# EAGLE design CocoBra (EAGLE 6.3)
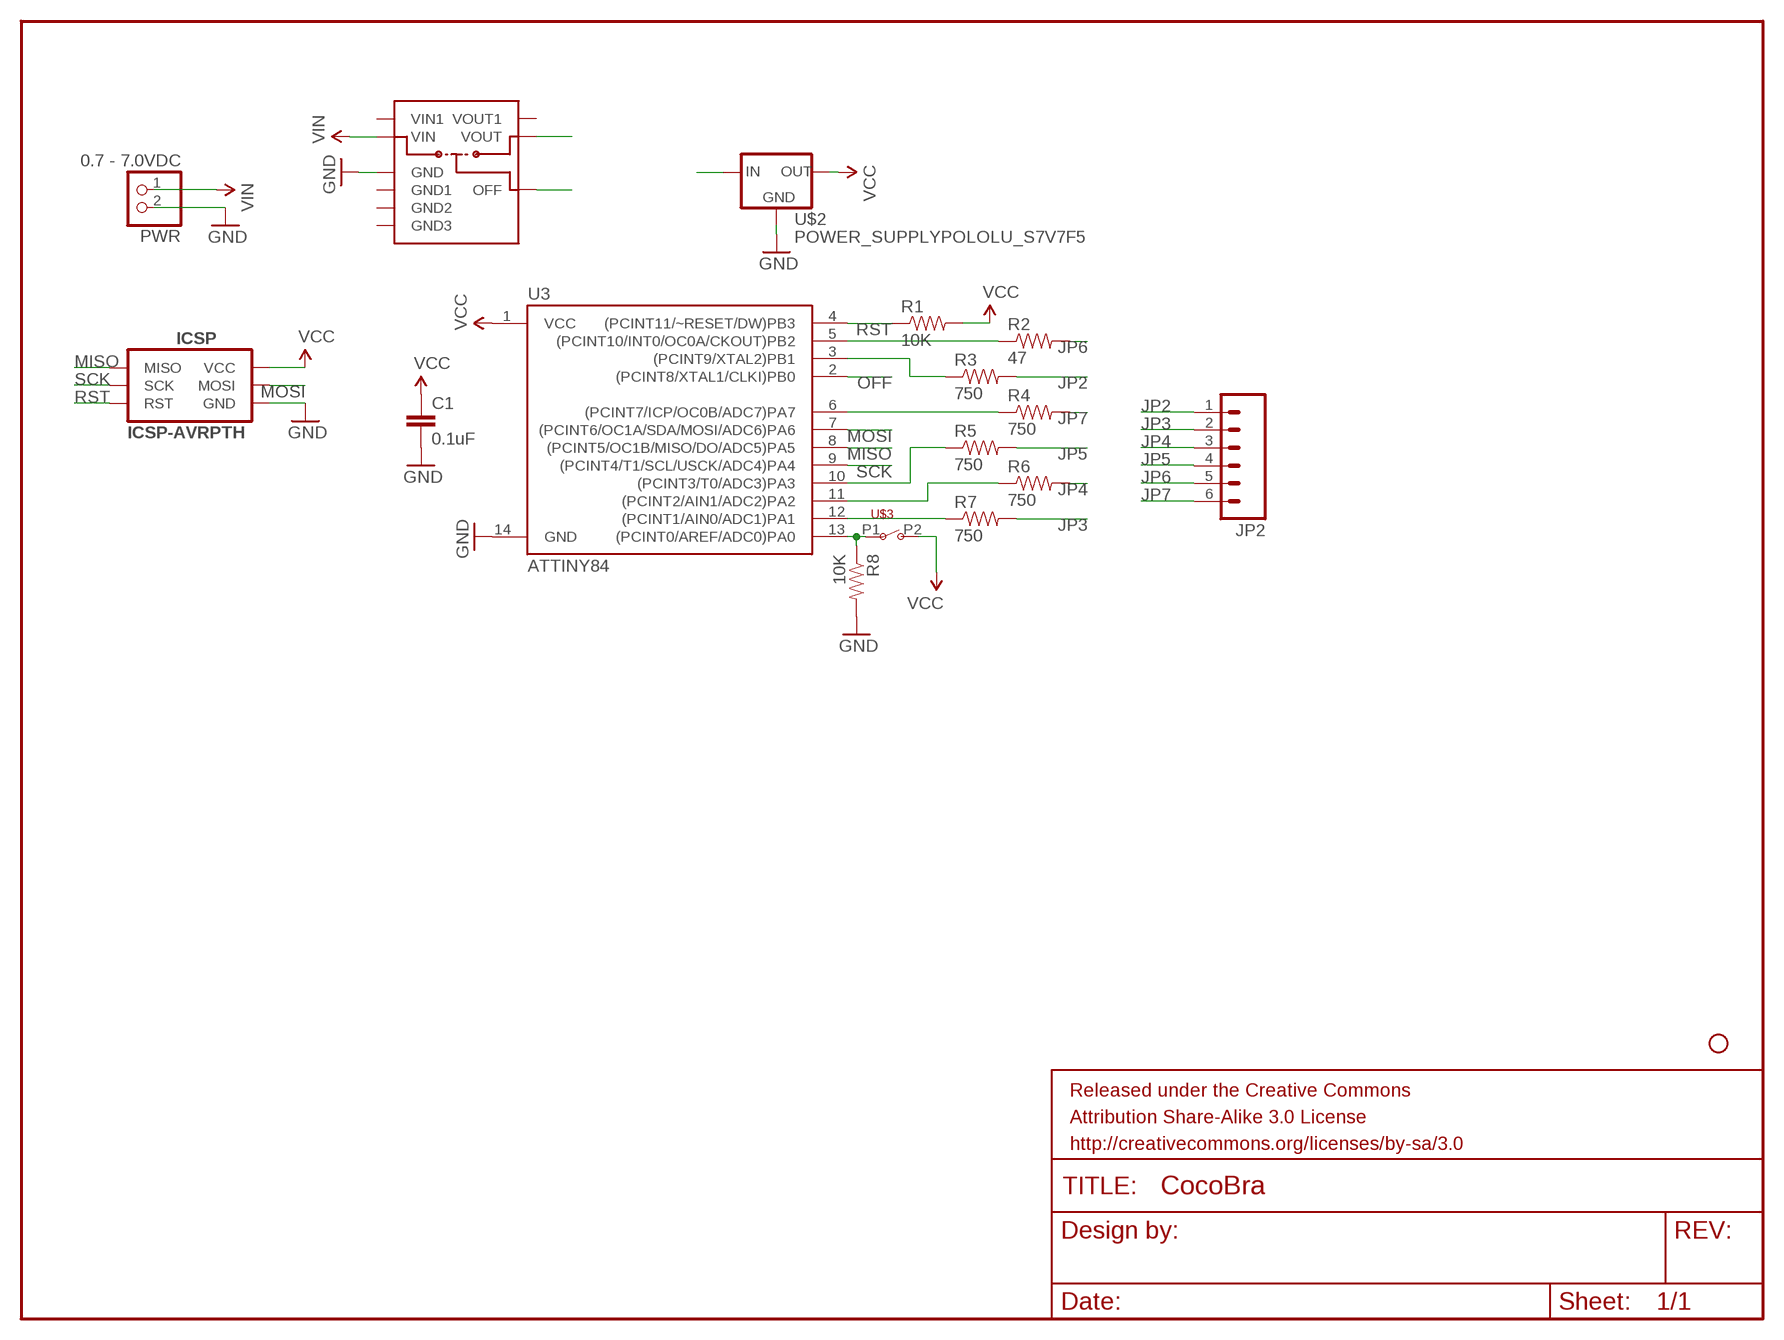
[diagram p0: schematic, sheet 1]

## Parts
C1  0.1uF  CAPPTH2  [CAP-PTH-SMALL2]
FRAME1  FRAME-LETTER  [CREATIVE_COMMONS]
ICSP  ICSP-AVRPTH  [2X3-SHROUDED]
JP2  M06SIP  [1X06]
PWR  0.7 - 7.0VDC  JST_2PIN-THM-RA  [JST-PH-2-THM-RA]
R1  10K  RESISTORAXIAL-0.2  [AXIAL-0.2]
R2  47  RESISTORAXIAL-0.3  [AXIAL-0.3]
R3  750  RESISTORAXIAL-0.3  [AXIAL-0.3]
R4  750  RESISTORAXIAL-0.3  [AXIAL-0.3]
R5  750  RESISTORAXIAL-0.3  [AXIAL-0.3]
R6  750  RESISTORAXIAL-0.3  [AXIAL-0.3]
R7  750  RESISTORAXIAL-0.3  [AXIAL-0.3]
R8  10K  RESISTORAXIAL-0.2  [AXIAL-0.2]
STANDOFF3  STAND-OFF#2  [STAND-OFF-#2]
U3  ATTINY84  ATTINY84DIL14  [DIL14]
U$2  POWER_SUPPLYPOLOLU_S7V7F5  [POLOLU_POWER_SUPPLY_S7V7F5]
U$3  SWITCH-SPSTTILT  [SWITCH-SPST-TILT]
U$4  POLOLU_POWER_SWITCHPTH  [POLOLU_POWER_SWITCH]

## Nets
GND [power]: C1.2 ICSP.6(GND) PWR.2 R8.P$2 U3.14(GND) U$2.GND U$4.GND
JP2: JP2.1 R3.P$2
JP3: JP2.2 R7.P$2
JP4: JP2.3 R6.P$2
JP5: JP2.4 R5.P$2
JP6: JP2.5 R2.P$2
JP7: JP2.6 R4.P$2
MISO: ICSP.1(MISO) U3.8((PCINT5/OC1B/MISO/DO/ADC5)PA5)
MOSI: ICSP.4(MOSI) U3.7((PCINT6/OC1A/SDA/MOSI/ADC6)PA6)
N$1: R2.P$1 U3.5((PCINT10/INT0/OC0A/CKOUT)PB2)
N$2: R3.P$1 U3.3((PCINT9/XTAL2)PB1)
N$3: R4.P$1 U3.6((PCINT7/ICP/OC0B/ADC7)PA7)
N$4: R5.P$1 U3.10((PCINT3/T0/ADC3)PA3)
N$5: R6.P$1 U3.11((PCINT2/AIN1/ADC2)PA2)
N$6: R7.P$1 U3.12((PCINT1/AIN0/ADC1)PA1)
N$7: R8.P$1 U3.13((PCINT0/AREF/ADC0)PA0) U$3.P1
OFF: U3.2((PCINT8/XTAL1/CLKI)PB0) U$4.OFF
RST: ICSP.5(RST) R1.P$1 U3.4((PCINT11/~RESET/DW)PB3)
SCK: ICSP.3(SCK) U3.9((PCINT4/T1/SCL/USCK/ADC4)PA4)
VCC: C1.1 ICSP.2(VCC) R1.P$2 U3.1(VCC) U$2.VOUT(OUT) U$3.P2
VIN [power]: PWR.1 U$4.VIN
VOUT: U$2.VIN(IN) U$4.VOUT
Unconnected: U$4.GND1 U$4.GND2 U$4.GND3 U$4.VIN1 U$4.VOUT1

## Library data of the parts
C1 = Dek:CAP: Capacitor Standard 0603 ceramic capacitor, and 0.1" leaded capacitor.
FRAME1 = SparkFun-Aesthetics:FRAME-LETTER: Schematic Frame Standard 8.5x11 US Letter frame
ICSP = Dek:ICSP-AVR
JP2 = SparkFun-Connectors:M06: Header 6 Standard 6-pin 0.1" header. Use with straight break away headers (SKU : PRT-00116), right angle break away headers (PRT-00553), swiss pins (PRT-00743), machine pins (PRT-00117), and female headers (PRT-00115). Molex polarized connector foot print use with SKU : PRT-08094 with associated crimp pins and housings. NOTES ON THE VARIANTS LOCK and LOCK_LONGPADS... This footprint was designed to help hold the alignment of a through-hole component (i.e. 6-pin header) while soldering it into place. You may notice that each hole has been shifted either up or down by 0.005 of an inch from it's more standard position (which is a perfectly straight line). This slight alteration caused the pins (the squares in the middle) to touch the edges of the holes. Because they are alternating, it causes a "brace" to hold the component in place. 0.005 has proven to be the perfect amount of "off-center" position when using our standard breakaway headers. Although looks a little odd when you look at the bare footprint, once you have a header in there, the alteration is very hard to notice. Also, if you push a header all the way into place, it is covered up entirely on the bottom side. This idea of altering the position of holes to aid alignment will be further integrated into the Sparkfun Library for other footprints. It can help hold any component with 3 or more connection pins.
PWR = Dek:JST_2PIN: JST 2-Pin Connectors of various flavors SMT-RA (S2B-PH-SM4) 4UConnector #17311 SMT (B2B-PH-SM4) THM-RA (S2B-PH) THM (B2B-PH)
R1-R8 = Dek:RESISTOR: Resistor Basic schematic elements and footprints for 0603, 1206, and PTH resistors.
STANDOFF3 = Dek:STAND-OFF: Stand Off This is the mechanical footprint for a #2 phillips button head screw. Use the keepout ring to avoid running the screw head into surrounding components.
U3 = Dek:ATTINY84: Atmel 14-pin 2/4/8kB flash uC
U$2 = Dek:POWER_SUPPLY
U$3 = Dek:SWITCH-SPST
U$4 = Dek:POLOLU_POWER_SWITCH

## Net classes
1 power: width 0.305 mm, clearance 0.305 mm

## Board
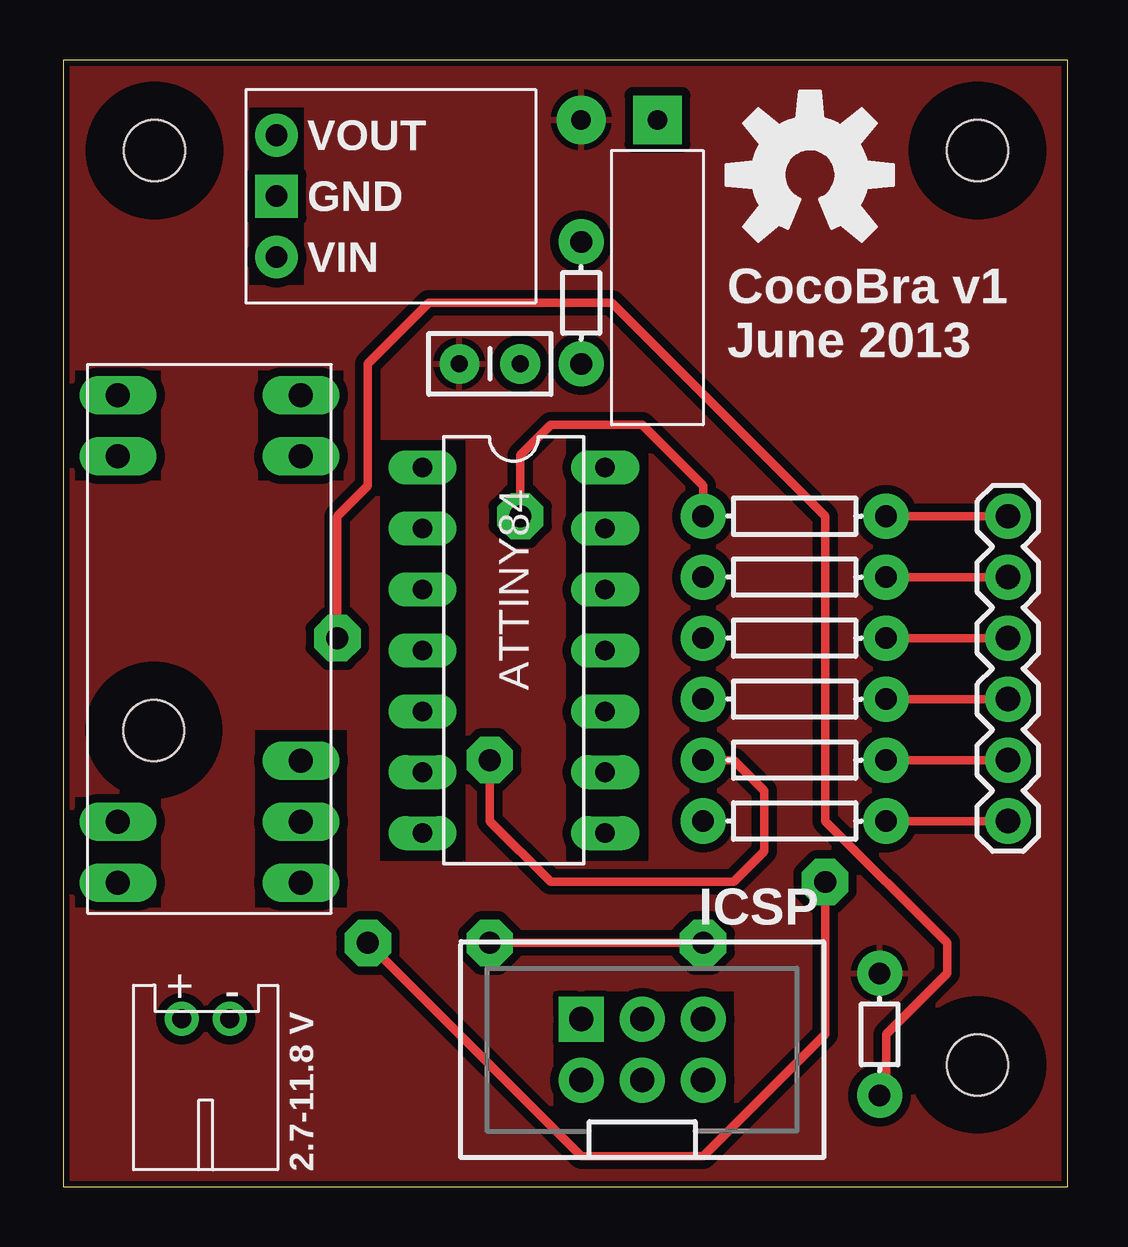
[diagram p1: board, top side]
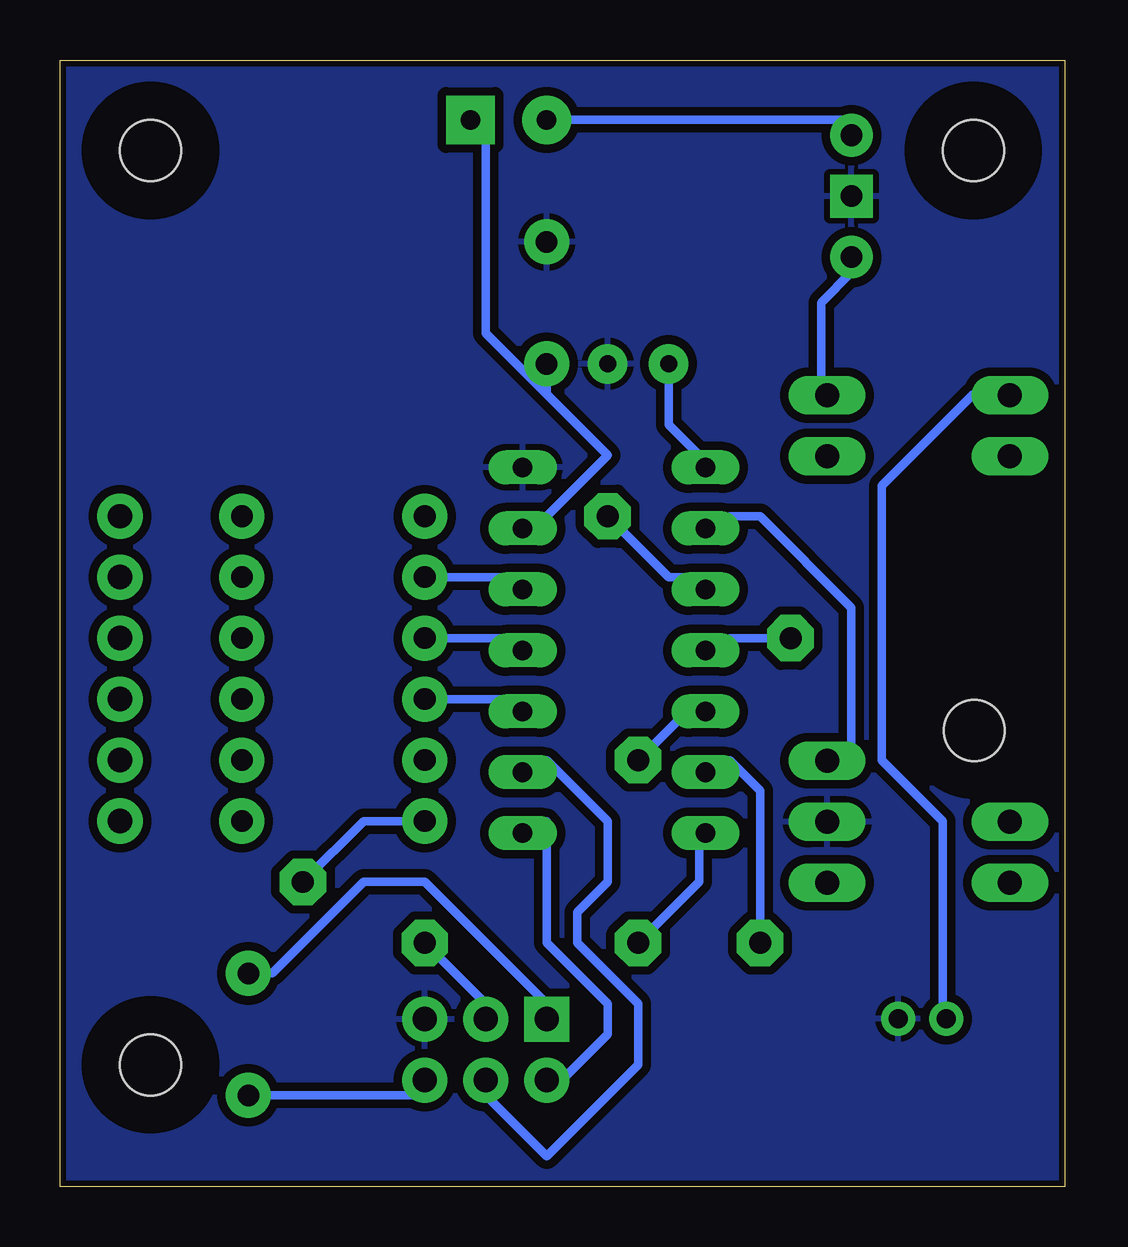
[diagram p2: board, bottom side, seen from below]

Size 41.87 x 46.95 mm. Coordinates in mm from the lower left corner, seen from the top.
Outline: 0,0 41.87,0 41.87,46.95 0,46.95 0,0
Copper layers (1*16): Top 0.035mm / dielectric 1.5mm / Bottom 0.035mm
Design rules "Dek": minimum track width 14mil, minimum drill 36mil, track to track 14mil, track to pad 14mil, pad to pad 14mil, via to via 14mil, smd to smd 0mil, copper to edge 10mil, drill to drill 12mil, minimum pad ring 12mil, minimum via ring 20mil, stop-mask expansion 4mil, vias tented up to drill 25mil, thermal gap 10mil
tRestrict: area 20.4,3.3 to 27.9,8.1; area 7.7,37.6 to 10,45; area 0.5,29.4 to 4.1,34; area 8.1,29.4 to 11.7,34; area 0.5,11.7 to 4.1,16.2; area 8,11.7 to 11.8,19; area 13.2,13.6 to 16.8,31.1; area 21,13.6 to 24.4,31.1

### Footprints (pad centres in the part's own frame; a part is rotated, then mirrored left to right if it is on the bottom)
CAP-PTH-SMALL2 = drill 0.7 pad 1.651: 1 0,0; 2 2.54,0
2X3-SHROUDED = drill 1.016 pad 1.88: 1 -1.27,2.54; 3 -1.27,0; 4 1.27,0; 5 -1.27,-2.54; 6 1.27,-2.54 | drill 1.016 pad 1.88 square: 2 1.27,2.54
1X06 = drill 1.016 pad 1.88: 1 0,0; 2 2.54,0; 3 5.08,0; 4 7.62,0; 5 10.16,0; 6 12.7,0
JST-PH-2-THM-RA = drill 0.8 pad 1.422: 1 1,0; 2 -1,0
AXIAL-0.2 = drill 0.9 pad 1.88: P$1 -2.54,0; P$2 2.54,0
AXIAL-0.3 = drill 0.9 pad 1.88: P$1 -3.81,0; P$2 3.81,0
STAND-OFF-#2 = hole 2.54: 0,0
DIL14 = drill 0.813 long: 1 -7.62,-3.81; 2 -5.08,-3.81; 3 -2.54,-3.81; 4 0,-3.81; 5 2.54,-3.81; 6 5.08,-3.81; 7 7.62,-3.81; 8 7.62,3.81; 9 5.08,3.81; 10 2.54,3.81; 11 0,3.81; 12 -2.54,3.81; 13 -5.08,3.81; 14 -7.62,3.81
POLOLU_POWER_SUPPLY_S7V7F5 = drill 0.9 pad 1.778 square: GND 4.445,1.27 | drill 0.9 pad 1.778: VIN 6.985,1.27; VOUT 1.905,1.27
SWITCH-SPST-TILT = drill 0.813 pad 2.032 square: P1 1.905,-1.27 | drill 0.813 pad 2.032: P2 5.08,-1.27
POLOLU_POWER_SWITCH = drill 1 long: GND 8.89,3.81; GND1 8.89,1.27; GND2 1.27,3.81; GND3 1.27,1.27; OFF 8.89,6.35; VIN 1.27,21.59; VIN1 1.27,19.05; VOUT 8.89,21.59; VOUT1 8.89,19.05

### Placement (x,y rotation side)
C1  16.51,34.29 0 top
FRAME1  12.7,-7.62 0 top  (outside the outline)
ICSP  24.13,5.71 90 top
JP2  39.37,27.94 270 top
PWR  5.94,7 180 top
R1  34.02,6.35 90 top
R2  30.48,17.78 0 top
R3  30.48,27.94 0 top
R4  30.48,15.24 0 top
R5  30.48,20.32 0 top
R6  30.48,22.86 0 top
R7  30.48,25.4 0 top
R8  21.59,36.83 90 top
STANDOFF1  STAND-OFF#2  [STAND-OFF-#2]  38.1,43.18 0 top
STANDOFF2  STAND-OFF#2  [STAND-OFF-#2]  38.1,5.08 0 top
STANDOFF3  3.78,19.02 0 top
STANDOFF4  STAND-OFF#2  [STAND-OFF-#2]  3.81,43.18 0 top
U3  18.78,22.35 270 top
U$1  [OSHW-LOGO-L]  31.11,42.16 0 top
U$2  7.62,45.72 270 top
U$3  26.67,43.18 180 top
U$4  1.02,11.4 0 top

### Tracks (layer width: path | path; a pad name or v marks a point on that pad's centre or on a via)
GND
  pour Bottom: 0,0 0,48.26 44.45,48.26 44.45,0
JP2
  Top 0.356: JP2.1 R3.P$2
JP3
  Top 0.356: JP2.2 R7.P$2
JP4
  Top 0.356: JP2.3 R6.P$2
JP5
  Top 0.356: JP2.4 R5.P$2
JP6
  Top 0.356: JP2.5 R2.P$2
JP7
  Top 0.356: JP2.6 R4.P$2
MISO
  Bottom 0.356: U3.8 21.59,15.24 21.59,10.16 19.05,7.62 19.05,6.35 21.59,3.81 ICSP.1
MOSI  (via drill 0.91)
  Top 0.356: v26.67,10.16 v17.78,10.16
  Bottom 0.356: v17.78,10.16 15.24,12.7 15.24,15.24 U3.7 | v26.67,10.16 24.13,7.62 ICSP.4
N$1  (via drill 0.91)
  Top 0.356: v17.78,17.78 17.78,15.24 20.32,12.7 27.94,12.7 29.21,13.97 29.21,16.51 27.94,17.78 R2.P$1
  Bottom 0.356: v17.78,17.78 15.24,20.32 U3.5
N$2  (via drill 0.91)
  Top 0.356: v19.05,27.94 19.05,30.48 20.32,31.75 24.13,31.75 26.67,29.21 R3.P$1
  Bottom 0.356: v19.05,27.94 16.51,25.4 15.24,25.4 U3.3
N$3  (via drill 0.91)
  Top 0.356: v12.7,10.16 21.59,1.27 26.67,1.27 31.75,6.35 v31.75,12.7
  Bottom 0.356: v12.7,10.16 12.7,16.51 13.97,17.78 U3.6 | v31.75,12.7 29.21,15.24 R4.P$1
N$4
  Bottom 0.356: R5.P$1 22.86,20.32 U3.10
N$5
  Bottom 0.356: R6.P$1 22.86,22.86 U3.11
N$6
  Bottom 0.356: R7.P$1 22.86,25.4 U3.12
N$7
  Bottom 0.356: 21.59,33.02 19.05,30.48 21.59,27.94 U3.13 | R8.P$1 21.59,33.02 | 21.59,33.02 24.13,35.56 24.13,44.45 U$3.P1
OFF
  Bottom 0.356: U3.2 13.97,27.94 12.7,27.94 8.89,24.13 8.89,17.78 U$4.OFF
RST  (via drill 0.91)
  Top 0.356: v11.43,22.86 11.43,27.94 12.7,29.21 12.7,34.29 15.24,36.83 22.86,36.83 31.75,27.94 31.75,15.24 36.83,10.16 36.83,8.89 34.29,6.35 34.29,3.81 R1.P$1
  Bottom 0.356: v11.43,22.86 13.97,22.86 U3.4 | ICSP.5 26.67,3.81 R1.P$1 34.29,3.81
SCK
  Bottom 0.356: U3.9 21.59,17.78 19.05,15.24 19.05,12.7 20.32,11.43 20.32,10.16 17.78,7.62 17.78,5.08 21.59,1.27 24.13,3.81 ICSP.3
VCC
  Bottom 0.356: C1.1 16.51,31.75 15.24,30.48 U3.1 | U$3.P2 8.89,44.45 U$2.VOUT | ICSP.2 21.59,7.62 26.67,12.7 29.21,12.7 33.02,8.89 R1.P$2 34.29,8.89
  pour Top: 0,0 0,49.53 43.18,49.53 43.18,0
VIN
  Bottom 0.356: PWR.1 5.08,7.62 5.08,15.24 7.62,17.78 7.62,29.21 3.81,33.02 2.54,33.02 U$4.VIN
VOUT
  Bottom 0.356: U$4.VOUT 10.16,33.02 10.16,36.83 8.89,38.1 U$2.VIN

### Text on the board
tPlace: CocoBra v1 / June 2013 | 2.7-11.8 V